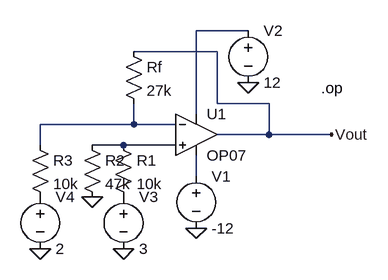
[diagram p0: schematic DifferentialAmplifier.asc]
DifferentialAmplifier.asc, the LTspice schematic file:
Version 4
SHEET 1 880 680
WIRE 256 0 176 0
WIRE 208 32 80 32
WIRE 208 112 208 32
WIRE 288 112 208 112
WIRE 176 128 176 0
WIRE 80 144 80 112
WIRE 80 144 -64 144
WIRE 144 144 80 144
WIRE 288 160 288 112
WIRE 288 160 208 160
WIRE 384 160 288 160
WIRE -64 176 -64 144
WIRE 64 176 16 176
WIRE 144 176 64 176
WIRE 176 224 176 192
FLAG 176 304 0
FLAG 256 80 0
FLAG 64 336 0
FLAG -64 336 0
FLAG 16 256 0
FLAG 384 160 Vout
SYMBOL OpAmps\\OP07 176 96 R0
SYMATTR InstName U1
SYMBOL voltage 176 208 R0
WINDOW 123 0 0 Left 0
WINDOW 39 0 0 Left 0
SYMATTR InstName V1
SYMATTR Value -12
SYMBOL voltage 256 -16 R0
SYMATTR InstName V2
SYMATTR Value 12
SYMBOL res 48 160 R0
SYMATTR InstName R1
SYMATTR Value 10k
SYMBOL res 0 160 R0
SYMATTR InstName R2
SYMATTR Value 47k
SYMBOL res -80 160 R0
SYMATTR InstName R3
SYMATTR Value 10k
SYMBOL voltage 64 240 R0
WINDOW 123 0 0 Left 0
WINDOW 39 0 0 Left 0
SYMATTR InstName V3
SYMATTR Value 3
SYMBOL voltage -64 240 R0
WINDOW 123 0 0 Left 0
WINDOW 39 0 0 Left 0
SYMATTR InstName V4
SYMATTR Value 2
SYMBOL res 64 16 R0
SYMATTR InstName Rf
SYMATTR Value 27k
TEXT 368 88 Left 2 !.op

The netlist it stands for:
* DifferentialAmplifier.asc
XU1 N003 N002 N001 N004 Vout LT1001  ; OP07, pins In+ In- V+ V- OUT
V1 N004 0 -12
V2 N001 0 12
R1 N003 P001 10k
R2 N003 0 47k
R3 N002 P002 10k
V3 P001 0 3
V4 P002 0 2
Rf Vout N002 27k
.op
.lib LTC.lib
.backanno
.end